# EAGLE design bq25505V1 (EAGLE 7.2.0)
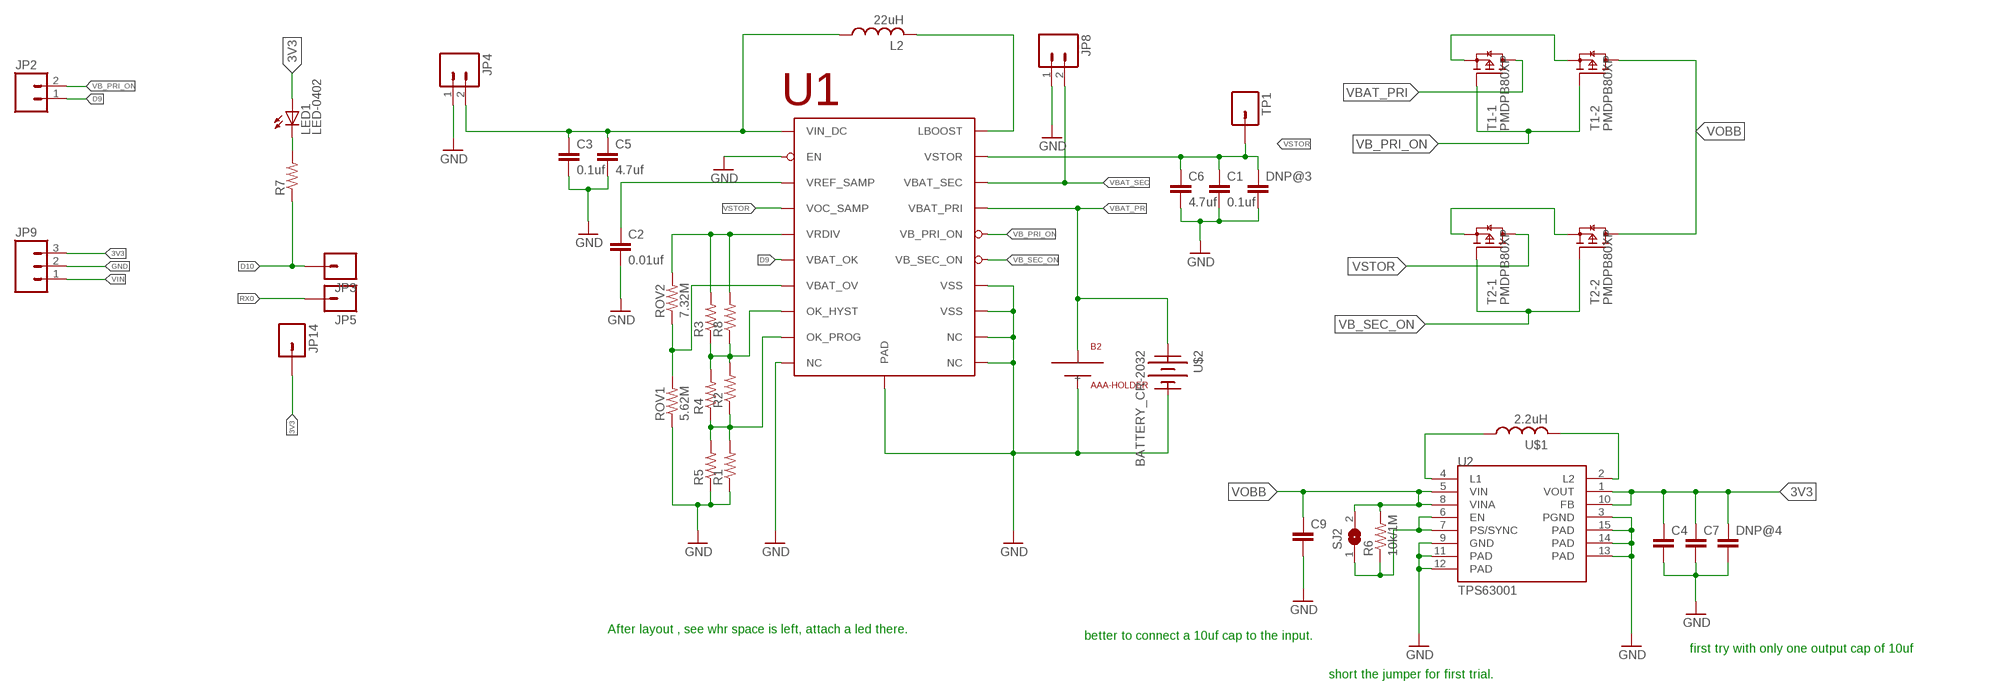
[diagram p0: schematic, sheet 1]

## Parts
B2  AAA-HOLDER  [AAA-BATTERY]
C1  0.1uf  C-EUC0805  [C0805]
C2  0.01uf  C-EUC0805  [C0805]
C3  0.1uf  C-EUC0805  [C0805]
C4  C-EUC0805  [C0805]
C5  4.7uf  C-EUC0805  [C0805]
C6  4.7uf  C-EUC0805  [C0805]
C7  C-EUC0805  [C0805]
C9  C-EUC0805  [C0805]
DNP@3  C-EUC0805  [C0805]
DNP@4  C-EUC0805  [C0805]
JP2  M02PTH  [1X02]
JP3  M01PTH  [1X01]
JP4  M02-JST-2-PTH-NO_SILK  [JST-2-PTH-NS]
JP5  M01PTH  [1X01]
JP8  M02-JST-2-PTH-NO_SILK  [JST-2-PTH-NS]
JP9  M03PTH  [1X03]
JP14  M01PTH  [1X01]
L2  22uH  LPS6235  [LPS6235]
LED1  LED-0402  [0402]
R1  R-US_R0603  [R0603]
R2  R-US_R0805  [R0805]
R3  R-US_R0603  [R0603]
R4  R-US_R1206  [R1206]
R5  R-US_R0603  [R0603]
R6  10k/1M  R-US_R0805  [R0805]
R7  R-US_R0603  [R0603]
R8  R-US_R0805  [R0805]
ROV1  5.62M  R-US_R1206  [R1206]
ROV2  7.32M  R-US_R1206  [R1206]
SJ2  SJ  [SJ]
T1  PMDPB80XP  [SOT1118]
T2  PMDPB80XP  [SOT1118]
TP1  M01PTH  [1X01]
U1  BQ25505  [VQFN-20]
U2  TPS63001  [QFN-10_PAD]
U$1  2.2uH  LPS3010  [LPS3010]
U$2  BATTERY_CR-2032  [BATTCON_20MM]

## Nets
3V3: C4.1 C7.1 DNP@4.1 JP9.3 JP14.1 LED1.P$1(A) U2.1(VOUT) U2.10(FB)
D9: JP2.1 U1.P$13(VBAT_OK)
D10: JP3.1 R7.1
GND: B2.P$2(-) C1.2 C2.2 C3.2 C4.2 C5.2 C6.2 C7.2 C9.2 DNP@3.2 DNP@4.2 JP4.1 JP8.1 JP9.2 R1.1 R5.1 ROV1.1 U1.P$1(VSS) U1.P$5(EN) U1.P$6(NC) U1.P$15(VSS) U1.P$16(NC) U1.P$17(NC) U1.P$21(PAD) U2.3(PGND) U2.9(GND) U2.11(PAD) U2.12(PAD) U2.13(PAD) U2.14(PAD) U2.15(PAD) U$2.2(-2)
L1: U2.4(L1) U$1.P$1
L2: U2.2(L2) U$1.P$2
LBOOST: L2.P$2 U1.P$20(LBOOST)
N$4: C2.1 U1.P$4(VREF_SAMP)
N$5: T1.1(-1:S) T1.4(-2:S)
N$8: T2.1(-1:S) T2.4(-2:S)
N$16: LED1.P$2(C) R7.2
OK_HYST: R2.2 R3.1 R4.2 R8.1 U1.P$11(OK_HYST)
OK_PROG: R1.2 R2.1 R4.1 R5.2 U1.P$12(OK_PROG)
PS/SYNC: R6.1 SJ2.1 U2.6(EN) U2.7(PS/SYNC)
RX0: JP5.1
VB_PRI_ON: JP2.2 T1.2(-1:G) T1.5(-2:G) U1.P$10(VB_PRI_ON)
VB_SEC_ON: T2.2(-1:G) T2.5(-2:G) U1.P$9(VB_SEC_ON)
VBAT_OV: ROV1.2 ROV2.1 U1.P$7(VBAT_OV)
VBAT_PRI: B2.P$1(+) T1.6(-1:D) T1.7(-1:D) U1.P$14(VBAT_PRI) U$2.1(+2) U$2.3(+2)
VBAT_SEC: JP8.2 U1.P$18(VBAT_SEC)
VIN: JP9.1
VIN_DC: C3.1 C5.1 JP4.2 L2.P$1 U1.P$2(VIN_DC)
VOBB: C9.1 R6.2 SJ2.2 T1.3(-2:D) T1.8(-2:D) T2.3(-2:D) T2.8(-2:D) U2.5(VIN) U2.8(VINA)
VRDIV: R3.2 R8.2 ROV2.2 U1.P$8(VRDIV)
VSTOR: C1.1 C6.1 DNP@3.1 T2.6(-1:D) T2.7(-1:D) TP1.1 U1.P$3(VOC_SAMP) U1.P$19(VSTOR)

## Notes on the sheet
- After layout , see whr space is left, attach a led there.
- better to connect a 10uf cap to the input.
- first try with only one output cap of 10uf
- short the jumper for first trial.

## Library data of the parts
B2 = AAA-HOLDER:AAA-HOLDER
C1-C7 C9 DNP@3 DNP@4 = rcl:C-EU: CAPACITOR, European symbol
JP2 JP4 JP8 = SparkFun-Connectors:M02: Standard 2-pin 0.1" header. Use with - straight break away headers ( PRT-00116) - right angle break away headers (PRT-00553) - swiss pins (PRT-00743) - machine pins (PRT-00117) - female headers (PRT-00115) Molex polarized connector foot print use with: PRT-08233 with associated crimp pins and housings. 2.54_SCREWTERM for use with PRT-10571. 3.5mm Screw Terminal footprints for PRT-08084 5mm Screw Terminal footprints for use with PRT-08432
JP3 JP5 JP14 TP1 = SparkFun-Connectors:M01: Header 1 Standard 1-pin 0.1" header. Use with straight break away headers (SKU : PRT-00116), right angle break away headers (PRT-00553), swiss pins (PRT-00743), machine pins (PRT-00117), and female headers (PRT-00115).
JP9 = SparkFun-Connectors:M03: Header 3 Standard 3-pin 0.1" header. Use with straight break away headers (SKU : PRT-00116), right angle break away headers (PRT-00553), swiss pins (PRT-00743), machine pins (PRT-00117), and female headers (PRT-00115). Molex polarized connector foot print use with SKU : PRT-08232 with associated crimp pins and housings.
L2 = lps6235:LPS6235
LED1 = led-0402:LED-0402
R1-R6 R8 ROV1 ROV2 = rcl:R-US_: RESISTOR, American symbol
R7 = resistor:R-US_: RESISTOR, American symbol
SJ2 = jumper:SJ: SMD solder JUMPER
T1 T2 = NXP_60_26022015:PMDPB80XP: 20 V, dual P-channel Trench MOSFET AAL Eindhoven MK
U1 = bq25505:BQ25505
U2 = TPS63001:TPS63001
U$1 = coilcraft:LPS3010
U$2 = CEDT_JANUARY_2015_v5:BATTERY

## Board
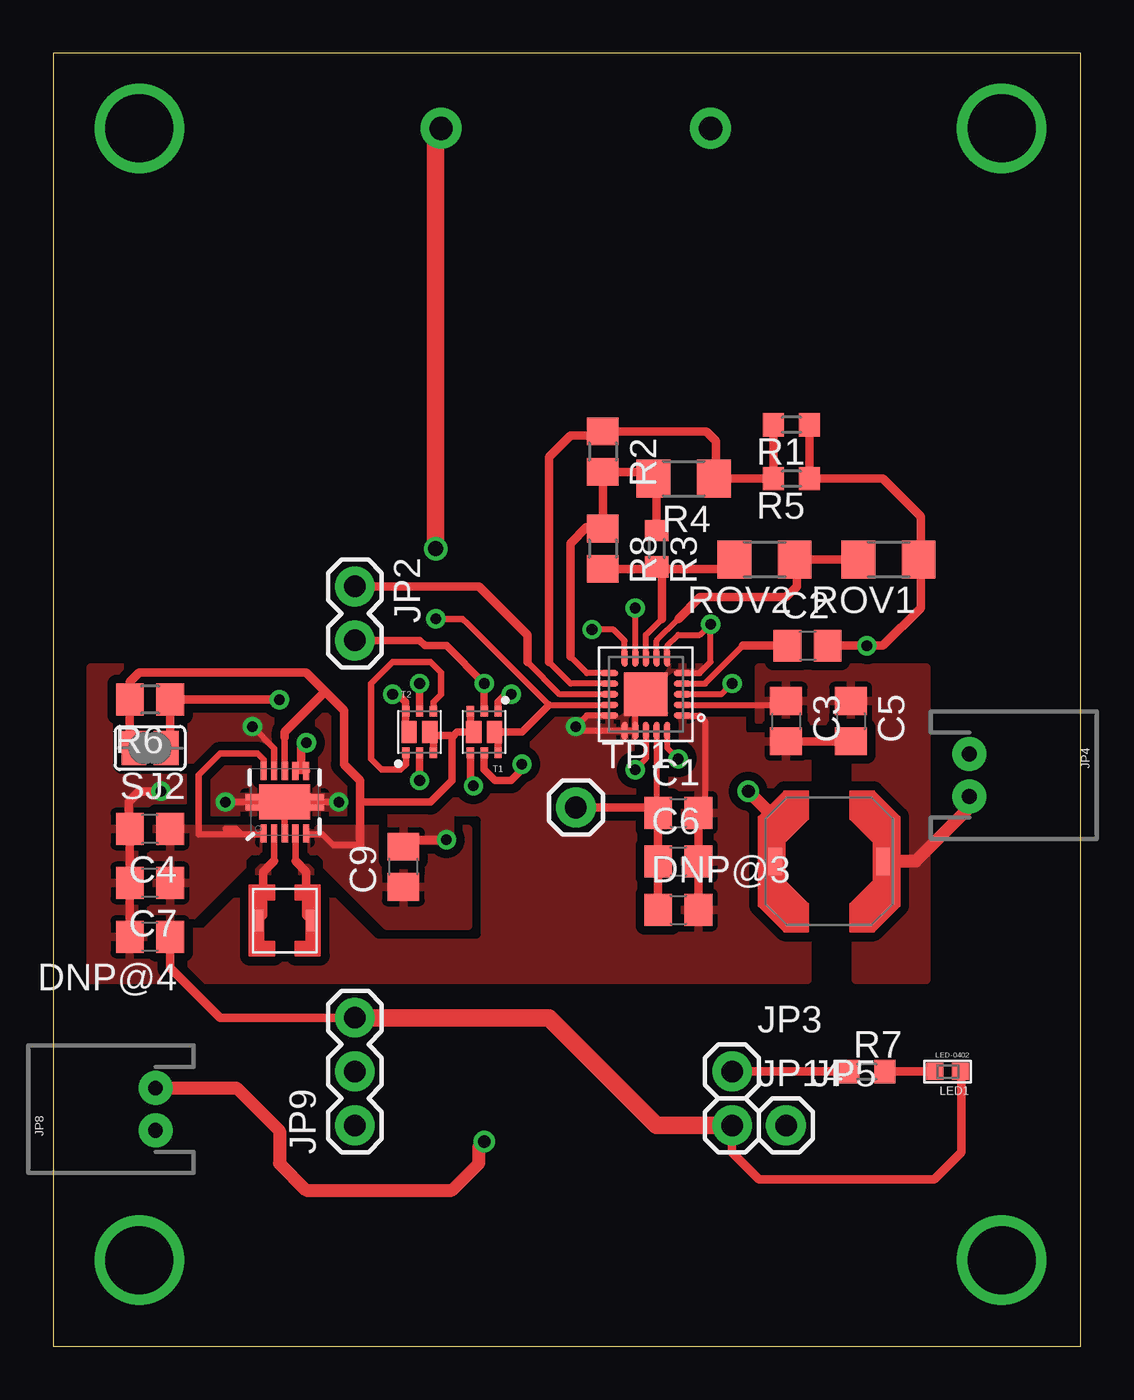
[diagram p1: board, top side]
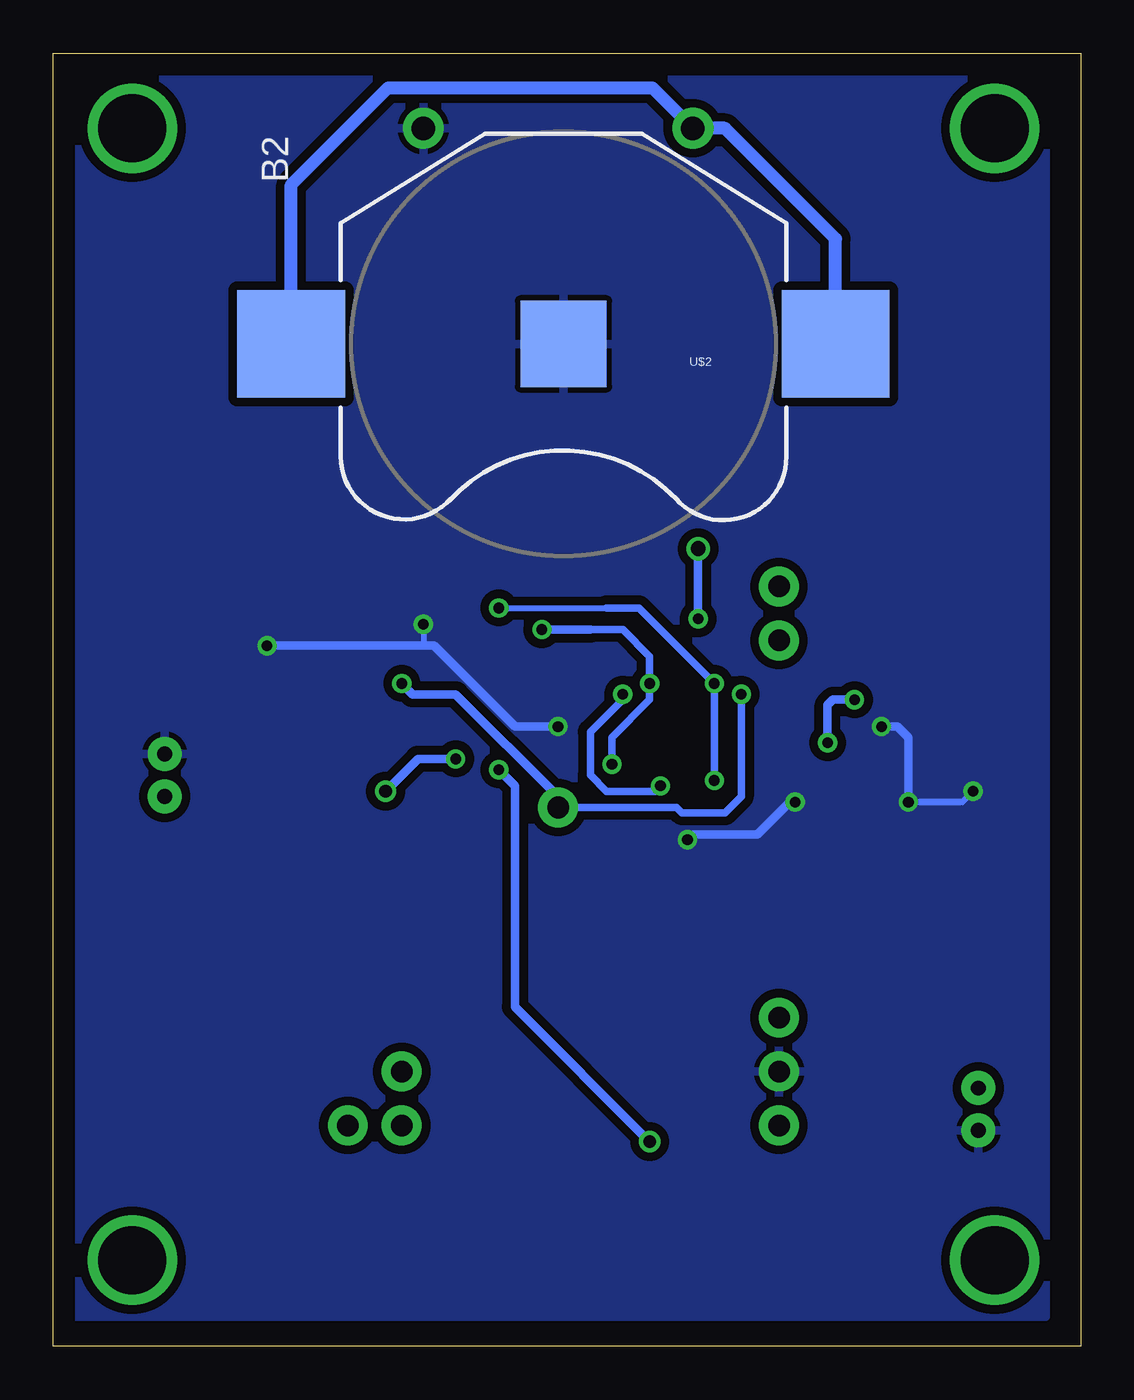
[diagram p2: board, bottom side, seen from below]

Size 48.44 x 60.95 mm. Coordinates in mm from the lower left corner, seen from the top.
Outline: 0,0 48.44,0 48.44,60.95 0,60.95 0,0
Copper layers (1*16): Top 0.035mm / dielectric 1.5mm / Bottom 0.035mm
Design rules "default": minimum track width 10mil, minimum drill 24mil, track to track 8mil, track to pad 8mil, pad to pad 8mil, via to via 8mil, smd to smd 8mil, copper to edge 40mil, drill to drill 8mil, minimum pad ring 10mil, minimum via ring 8mil, stop-mask expansion 4mil, vias tented up to drill 0mil, thermal gap 10mil

### Footprints (pad centres in the part's own frame; a part is rotated, then mirrored left to right if it is on the bottom)
AAA-BATTERY = drill 1.1 pad 1.93: P$1 22.86,-6.35; P$2 22.86,6.35
C0805 = smd 1.3 x 1.5: 1 -0.95,0; 2 0.95,0
1X02 = drill 1.016 pad 1.88: 1 0,0; 2 2.54,0
1X01 = drill 1.016 pad 1.88: 1 0,0
JST-2-PTH-NS = drill 0.7 pad 1.6: 1 -1,0; 2 1,0
1X03 = drill 1.016 pad 1.88: 1 0,0; 2 2.54,0; 3 5.08,0
LPS6235 = smd 0.635 x 1.27: P$1 -2.54,0; P$2 2.54,0
0402 = smd 0.8 x 0.8: P$1 -0.6,0; P$2 0.6,0
R0603 = smd 1 x 1.1: 1 -0.85,0; 2 0.85,0
R0805 = smd 1.3 x 1.5: 1 -0.95,0; 2 0.95,0
R1206 = smd 1.6 x 1.803: 1 -1.422,0; 2 1.422,0
SJ = smd 1.168 x 1.6: 1 -0.762,0; 2 0.762,0
SOT1118 = smd 0.35 x 0.5: 1 -0.65,-0.975; 2 0,-0.975; 3 0.65,-0.975; 4 0.65,0.975; 5 0,0.975; 6 -0.65,0.975 | smd 0.72 x 1.05: 7 -0.49,0; 8 0.49,0
VQFN-20 = smd 0.85 x 0.28: P$1 -1.725,1; P$2 -1.725,0.5; P$3 -1.725,0; P$4 -1.725,-0.5; P$5 -1.725,-1; P$11 1.725,-1; P$12 1.725,-0.5; P$13 1.725,0; P$14 1.725,0.5; P$15 1.725,1 | smd 0.28 x 0.85: P$6 -1,-1.725; P$7 -0.5,-1.725; P$8 0,-1.725; P$9 0.5,-1.725; P$10 1,-1.725; P$16 1,1.725; P$17 0.5,1.725; P$18 0,1.725; P$19 -0.5,1.725; P$20 -1,1.725 | smd 2.05 x 2.05: P$21 0,0
QFN-10_PAD = smd 0.297 x 0.85: 1 -1,-1.475; 2 -0.5,-1.475; 3 0,-1.475; 4 0.5,-1.475; 5 1,-1.475; 6 1,1.475; 7 0.5,1.475; 8 0,1.475; 9 -0.5,1.475; 10 -1,1.475 | smd 0.7 x 0.28: 11 -1.5,0.25; 12 -1.5,-0.25; 13 1.5,0.25; 14 1.5,-0.25 | smd 2.4 x 1.65: 15 0,0
LPS3010 = smd 0.508 x 1.016: P$1 -1.27,0; P$2 1.27,0
BATTCON_20MM = smd 5.08 x 5.08: 1 -12.827,0; 3 12.827,0 | smd 4.064 x 4.064: 2 0,0

### Placement (x,y rotation side)
B2  24.64,34.54 90 bottom
C1  29.46,25.15 0 top
C2  35.56,33.02 0 top
C3  34.54,29.46 270 top
C4  4.57,24.38 180 top
C5  37.59,29.46 270 top
C6  29.46,22.86 0 top
C7  4.57,21.84 180 top
C9  16.51,22.61 90 top
DNP@3  29.46,20.57 0 top
DNP@4  4.57,19.3 180 top
JP2  14.22,35.81 270 top
JP3  32,12.95 0 top
JP4  43.18,26.92 270 top
JP5  34.54,10.41 0 top
JP8  4.83,11.18 90 top
JP9  14.22,10.41 90 top
JP14  32,10.41 0 top
L2  36.58,22.86 180 top
LED1  42.16,12.95 180 top
R1  34.8,43.43 180 top
R2  25.91,42.16 270 top
R3  28.45,37.59 270 top
R4  29.72,40.89 180 top
R5  34.8,40.89 180 top
R6  4.57,30.48 180 top
R7  38.35,12.95 0 top
R8  25.91,37.59 270 top
ROV1  39.37,37.08 180 top
ROV2  33.53,37.08 180 top
SJ2  4.57,28.19 180 top
T1  20.32,28.96 180 top
T2  17.27,28.96 0 top
TP1  24.64,25.4 0 top
U1  27.94,30.73 180 top
U2  10.92,25.65 0 top
U$1  10.92,20.07 180 top
U$2  24.38,47.24 180 bottom

### Tracks (layer width: path | path; a pad name or v marks a point on that pad's centre or on a via)
3V3
  Top 0.305: 8.13,24.38 8.64,24.38 8.89,24.13 | 8.89,24.13 9.87,24.13 U2.1 | U2.10 9.92,27.67 9.65,27.94 7.87,27.94 6.86,26.92 6.86,24.13 8.89,24.13
  Top 0.406: DNP@4.1 5.52,17.85 7.87,15.49 JP9.3 | JP14.1 32,9.14 33.27,7.87 41.53,7.87 42.8,9.14 42.8,12.92 LED1.P$1
  Top 0.813: JP9.3 23.37,15.49 28.45,10.41 JP14.1
  pour Top (isolate 0.406, rank 2): 9.91,24.38 4.57,24.38 4.57,19.81 6.1,19.81 9.91,23.62
D9
  Top 0.279: U1.P$13 23.88,30.73 22.35,32.26
  Top 0.406: JP2.1 20.07,35.81 22.35,33.53 22.35,32.26
D10
  Top 0.406: JP3.1 R7.1
GND  (via drill 0.5)
  Top 0.279: U1.P$1 30.46,29.73 30.73,29.46 30.73,25.47 C1.2 | U1.P$21 27.44,30.23 U1.P$17 U1.P$16 24.84,29.01 v24.64,29.21 25.16,29.73 U1.P$15 | U1.P$5 30.46,31.73 30.99,32.26 v30.99,34.04 30.48,33.53 29.46,33.53 28.94,33 U1.P$6
  Top 0.305: U2.3 U2.15 | U2.14 U2.13 11.17,25.9 U2.15 | U2.12 U2.11 9.42,25.68 9.4,25.65 | U2.15 v13.46,25.65 | U2.15 9.4,25.65 | 9.4,25.65 v8.13,25.65 | 3.56,24.45 C4.2 | U2.9 10.42,28.19 v9.4,29.21
  Top 0.406: C3.2 C5.2 | C1.2 C6.2 DNP@3.2 | R1.1 R5.1 39.12,40.89 40.89,39.12 40.89,37.19 ROV1.1 40.89,36.98 40.89,34.8 39.12,33.02 v38.35,33.02 C2.2 | v5.08,26.16 4.06,26.16 3.56,25.65 3.56,24.45 | C4.2 C7.2 DNP@4.2 | v18.54,23.88 16.83,23.88 C9.2
  Bottom 0.279: v30.99,34.04 30.99,33.02
  Bottom 0.305: v8.13,25.65 5.59,25.65 v5.08,26.16
  Bottom 0.406: v9.4,29.21 8.64,29.21 8.13,28.7 v8.13,25.65 | v38.35,33.02 30.99,33.02 30.48,33.02 26.67,29.21 v24.64,29.21 | v13.46,25.65 13.72,25.65 15.24,24.13 18.29,24.13 v18.54,23.88
  pour Bottom (isolate 0.406): 1.65,60.2 47.5,60.2 47.5,1.4 1.65,1.4
  pour Top (isolate 0.406, rank 3): 1.78,17.27 35.56,17.27 35.56,32 1.78,32
L1
  Top 0.305: U2.4 11.42,22.87
  Top 0.406: 11.42,22.87 11.94,22.35 11.94,20.32 U$1.P$1
  pour Top (isolate 0.406): 11.94,22.61 13.72,20.83 13.72,18.29 11.43,18.29 11.43,22.1
L2
  Top 0.305: U2.2 10.42,22.87
  Top 0.406: 10.42,22.87 9.91,22.35 9.91,20.32 U$1.P$2
  pour Top (isolate 0.406): 9.91,22.61 8.13,20.83 8.13,18.29 10.41,18.29 10.41,22.1
LBOOST  (via drill 0.5, 0.6)
  Top 0.279: U1.P$20 28.94,28.21 v29.46,27.69
  Top 0.406: 34.29,24.64 34.29,23.11 L2.P$2
  Top 0.61: v32.77,26.16 34.29,24.64
  Bottom 0.406: v29.46,27.69 31.24,27.69 v32.77,26.16
N$2  (via drill 3.2)
  other vias: 4.06,57.4
N$3  (via drill 3.2)
  other vias: 44.7,57.4
N$4
  Top 0.279: U1.P$4 30.73,31.23 32.51,33.02
  Top 0.406: 32.51,33.02 C2.1
N$5  (via drill 0.5)
  Top 0.356: T1.1 20.97,30.37 21.34,30.73 v21.59,30.73 | v19.81,26.42 19.68,26.54 19.68,27.97 T1.4
  Bottom 0.356: v21.59,30.73 21.59,30.48 23.11,28.96 23.11,26.92 22.35,26.16 20.07,26.16 v19.81,26.42
N$6  (via drill 3.2)
  other vias: 4.06,4.06
N$7  (via drill 3.2)
  other vias: 44.7,4.06
N$8
  Top 0.305: T2.4 17.92,30.37 18.29,30.73 18.29,31.75 17.78,32.26 16,32.26 14.99,31.24 14.99,27.69 15.49,27.18 16.38,27.18 16.64,27.43 16.64,27.97 T2.1
N$16
  Top 0.406: R7.2 LED1.P$2
OK_HYST
  Top 0.279: U1.P$11 25.16,31.73 24.38,32.51
  Top 0.406: 24.38,32.51 24.38,37.85 25.15,38.61 25.84,38.61 R8.1 | 25.84,38.1 R8.1 | R8.1 R2.2 27.98,41.21 R4.2 28.45,40.74 R3.1
OK_PROG
  Top 0.279: U1.P$12 24.39,31.23 23.37,32.26
  Top 0.406: R1.2 R5.2 R4.1 31.24,41 31.24,42.67 30.8,43.11 R2.1 25.72,42.93 24.38,42.93 23.37,41.91 23.37,32.26
PS/SYNC  (via drill 0.5)
  Top 0.305: U2.7 U2.6
  Top 0.406: v10.67,30.48 R6.1 5.52,28.38 SJ2.1 | v11.94,28.45 11.68,28.19 11.68,27.37 U2.6
  Bottom 0.406: v11.94,28.45 11.94,30.23 11.68,30.48 v10.67,30.48
VB_PRI_ON  (via drill 0.5)
  Top 0.279: U1.P$10 26.94,33.26 26.42,33.78 v25.4,33.78
  Top 0.356: T1.2 v20.32,31.24 18.54,33.02 17.53,33.02 17.27,33.27 JP2.2 | T1.5 20.32,27.18 20.83,26.67 21.59,26.67 22.1,27.18 v22.1,27.43
  Bottom 0.356: 23.11,33.78 21.59,33.78 20.32,32.51 v20.32,31.24 20.32,30.48 22.1,28.7 v22.1,27.43
  Bottom 0.406: v25.4,33.78 23.11,33.78
VB_SEC_ON  (via drill 0.5)
  Top 0.279: U1.P$9 v27.44,34.79 v27.43,34.8
  Top 0.356: T2.5 v17.27,31.24 | T2.2 v17.27,26.67
  Bottom 0.279: v27.43,34.8 22.35,34.8
  Bottom 0.356: 22.35,34.8 20.83,34.8 v17.27,31.24 v17.27,26.67
VBAT_OV
  Top 0.279: U1.P$7 28.44,33.27 29.46,34.29
  Top 0.406: 29.46,34.29 30.48,35.31 34.54,35.31 35.05,35.81 35.05,36.32 35.31,36.58 35.31,36.73 ROV2.1 ROV1.2
VBAT_PRI  (via drill 0.5, 0.7)
  Top 0.279: U1.P$14 23.37,30.23 19.56,34.04
  Top 0.305: v18.03,34.29 19.3,34.29 19.56,34.04
  Top 0.356: T1.6 20.97,28.8 T1.7 22.1,28.96 23.37,30.23
  Top 0.813: v18.03,37.59 18.03,57.15 B2.P$1
  Bottom 0.406: v18.03,37.59 v18.03,34.29
  Bottom 0.61: U$2.1 11.56,52.2 16.76,57.4 B2.P$1 20.19,59.31 32.64,59.31 37.21,54.74 U$2.3
VBAT_SEC  (via drill 0.5, 0.6)
  Top 0.279: U1.P$18 27.94,27.69 v27.43,27.18
  Top 0.61: JP8.2 8.65,12.18 10.67,10.16 10.67,8.64 11.94,7.37 18.8,7.37 20.07,8.64 20.07,9.4 v20.32,9.65
  Bottom 0.406: v27.43,27.18 26.67,26.42 26.67,16 v20.32,9.65
VIN_DC
  Top 0.279: U1.P$2 34.36,30.23 C3.1
  Top 0.61: JP4.2 43.18,25.4 40.64,22.86 L2.P$1
  pour Top (isolate 0.406): 41.15,32 33.27,32 33.27,29.46 37.85,29.46 37.85,17.27 41.15,17.27
VOBB
  Top 0.305: 14.48,23.62 13.21,23.62 12.7,24.13 11.97,24.13 U2.5 | U2.8 10.92,28.7
  Top 0.356: 12.83,30.86 12.95,30.73 | T1.3 19.67,29.12 T1.8 19.05,28.96 18.8,28.7 | T2.3 17.92,28.8 | 17.92,28.8 T2.8 | 18.8,28.7 18.8,26.67 17.78,25.65 14.48,25.65 | 17.92,28.8 18.7,28.8 18.8,28.7
  Top 0.406: 14.48,23.62 14.48,25.65 14.48,26.67 13.72,27.43 13.72,29.97 12.95,30.73 11.94,31.75 4.06,31.75 3.62,31.31 R6.2 3.62,28.38 SJ2.2 | 10.92,28.7 10.92,28.96 12.83,30.86
  pour Top (isolate 0.406, rank 2): 11.94,24.38 19.56,24.38 19.56,19.81 15.75,19.81 11.94,23.62
VRDIV
  Top 0.279: U1.P$8 27.94,33.53 28.7,34.29
  Top 0.406: 28.7,34.29 28.7,36.49 R3.2 28.35,36.64 | R8.2 28.35,36.64 | 28.35,36.64 31.66,36.64 ROV2.2
VSTOR  (via drill 0.5)
  Top 0.279: U1.P$19 28.44,25.22 C1.1 | v32,31.24 31.5,30.73 U1.P$3
  Top 0.356: v16,30.73 16.26,30.73 16.62,30.37 T2.6 16.62,29.12 T2.7
  Top 0.406: DNP@3.1 C6.1 C1.1 28.26,25.4 TP1.1
  Bottom 0.356: TP1.1 19.05,25.4 18.8,25.15 16.76,25.15 16,25.91 v16,30.73
  Bottom 0.406: v32,31.24 31.5,30.73 29.46,30.73 24.64,25.91 TP1.1